# Altium schematic sheet Overview.SchDoc
size A4; Organization: Altium Limited; Address1: L3, 12a Rodborough Rd; Address2: Frenchs Forest; Address3: NSW; Address4: Australia 2086; SheetNumber: 1; SheetTotal: 5
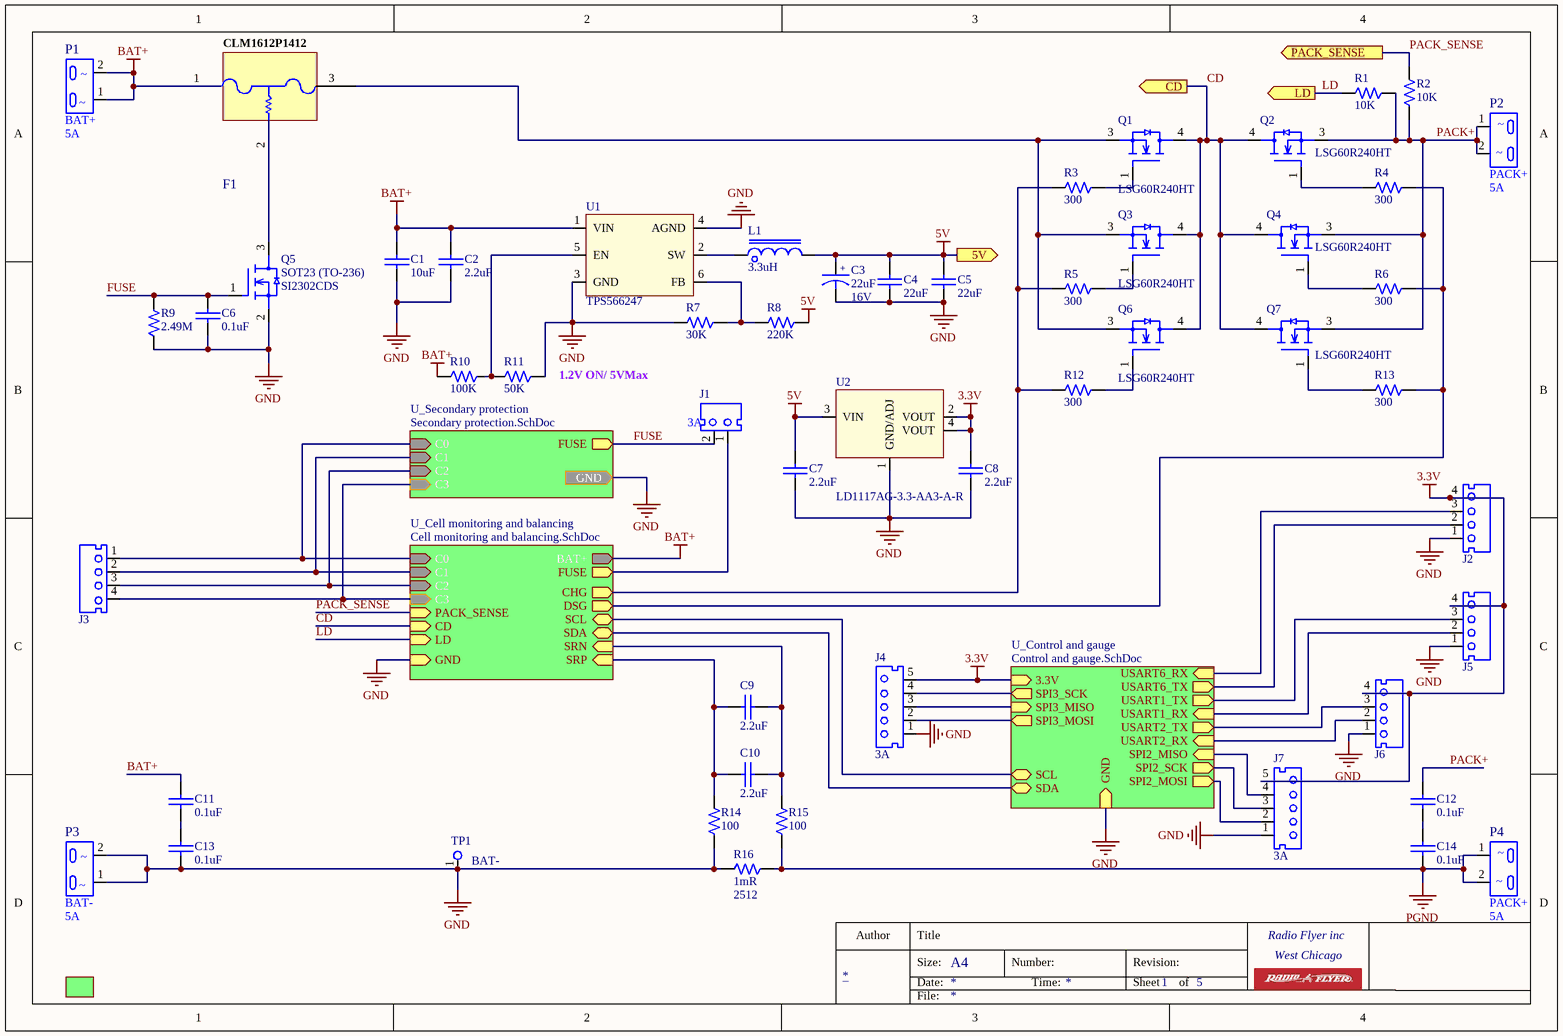
[diagram p0: Overview.SchDoc]

## Parts
C1  value 10uF  [CAPC0603-RW]  (hidden comment: T542021037308)
C2  value 2.2uF  [CAPC0603-RW]  (hidden comment: T542021037308)
C3  value 22uF  Voltage: 16V  [CASE - B]  (hidden comment: T551220435010)
C4  value 22uF  [CAPC0603-RW]  (hidden comment: T542021037308)
C5  value 22uF  [CAPC0603-RW]  (hidden comment: T542021037308)
C6  value 0.1uF  [CAPC0603-RW]  (hidden comment: T542021037308)
C7  value 2.2uF  [CAPC0603-RW]  (hidden comment: T542021037308)
C8  value 2.2uF  [CAPC0603-RW]  (hidden comment: T542021037308)
C9  value 2.2uF  [CAPC0603-RW]  (hidden comment: T542021037308)
C10  value 2.2uF  [CAPC0603-RW]  (hidden comment: T542021037308)
C11  value 0.1uF  [CAPC0603-RW]  (hidden comment: T542021037308)
C12  value 0.1uF  [CAPC0603-RW]  (hidden comment: T542021037308)
C13  value 0.1uF  [CAPC0603-RW]  (hidden comment: T542021037308)
C14  value 0.1uF  [CAPC0603-RW]  (hidden comment: T542021037308)
F1  KED500004-0010  [CLM1612P1412]  (value not drawn)
J1  Current: 3A  [CONN 2P PH=2.5mm B2B-XH-A]  (hidden comment: CCN250000-0102)
J2  T690300164400  [CONN 4P PH=2.5mm 440052-4]  (value not drawn)
J3  T690300164400  [CONN 4P PH=2.5mm 440052-4]  (value not drawn)
J4  Current: 3A  [CONN 5P PH=2.5mm Molex 99-99-0989]  (hidden comment: CCN250001-0105)
J5  T690300164400  [CONN 4P PH=2.5mm 440052-4]  (value not drawn)
J6  T690300164400  [CONN 4P PH=2.5mm 440052-4]  (value not drawn)
J7  Current: 3A  [CONN 5P PH=2.5mm Molex 99-99-0989]  (hidden comment: CCN250001-0105)
L1  value 3.3uH  [IND  CKST0603]  (hidden comment: T621000080700)
P1  MFG Part: BAT+  Current: 5A  [AC INLET 2P DB8-6S1]  (hidden comment: CJP012009-0070)
P2  MFG Part: PACK+  Current: 5A  [AC INLET 2P DB8-6S1]  (hidden comment: CJP012009-0070)
P3  MFG Part: BAT-  Current: 5A  [AC INLET 2P DB8-6S1]  (hidden comment: CJP012009-0070)
P4  MFG Part: PACK+  Current: 5A  [AC INLET 2P DB8-6S1]  (hidden comment: CJP012009-0070)
Q1  MFG Part: LSG60R240HT  [TO252-3]  (hidden comment: T5860038503A6)
Q2  MFG Part: LSG60R240HT  [TO252-3]  (hidden comment: T5860038503A6)
Q3  MFG Part: LSG60R240HT  [TO252-3]  (hidden comment: T5860038503A6)
Q4  MFG Part: LSG60R240HT  [TO252-3]  (hidden comment: T5860038503A6)
Q5  Package: SOT23 (TO-236)  [SOT23-132-RW]  (hidden comment: SI2302CDS)
Q6  MFG Part: LSG60R240HT  [TO252-3]  (hidden comment: T5860038503A6)
Q7  MFG Part: LSG60R240HT  [TO252-3]  (hidden comment: T5860038503A6)
R1  value 10K  [0603-RW]  (hidden comment: T502976002399)
R2  value 10K  [0603-RW]  (hidden comment: T502976002399)
R3  value 300  [0603-RW]  (hidden comment: T502976002399)
R4  value 300  [0603-RW]  (hidden comment: T502976002399)
R5  value 300  [0603-RW]  (hidden comment: T502976002399)
R6  value 300  [0603-RW]  (hidden comment: T502976002399)
R7  value 30K  [0603-RW]  (hidden comment: T502976002399)
R8  value 220K  [0603-RW]  (hidden comment: T502976002399)
R9  value 2.49M  [0603-RW]  (hidden comment: T502976002399)
R10  value 100K  [0603-RW]  (hidden comment: T502976002399)
R11  value 50K  [0603-RW]  (hidden comment: T502976002399)
R12  value 300  [0603-RW]  (hidden comment: T502976002399)
R13  value 300  [0603-RW]  (hidden comment: T502976002399)
R14  value 100  [0603-RW]  (hidden comment: T502976002399)
R15  value 100  [0603-RW]  (hidden comment: T502976002399)
R16  value 1mR  [2512]  (hidden comment: QCF101250-1009)
TP1  BAT-  [RT-01T-1.0B]
U1  MFG Part: TPS566247  [SOT-563]  (hidden comment: CD1053GTF-Z)
U2  MFG Part: LD1117AG-3.3-AA3-A-R  [SOT223]  (hidden comment: T610600036508)

## Sub-sheets
U_Cell monitoring and balancing = Cell monitoring and balancing.SchDoc: BAT+ (out), C0 (in), C1 (in), C2 (in), C3 (in), PACK_SENSE (in), CD (in), FUSE (out), LD (in), SDA (bidir), SCL (bidir), CHG (out), DSG (out), SRN (in), SRP (in), GND (in)
U_Control and gauge = Control and gauge.SchDoc: SDA (bidir), SCL (bidir), 3.3V (in), USART6_RX (in), USART6_TX (out), USART1_TX (out), USART1_RX (in), SPI3_SCK (out), SPI3_MISO (in), USART2_RX (in), SPI3_MOSI (out), USART2_TX (out), SPI2_SCK (out), SPI2_MOSI (out), SPI2_MISO (in), GND (in)
U_Main board frame = Main board frame.SchDoc: no entries
U_Secondary protection = Secondary protection.SchDoc: C0 (in), C1 (in), C2 (in), C3 (in), FUSE (out)

## Ports
5V (out), CD (out), GND (in), LD (out), PACK_SENSE (out)

## Nets
3.3V: C8.1 J2.4 J4.5 J5.4 J6.4 J7.5 U2.2(VOUT) U2.4(VOUT) ; sheet U_Control and gauge/3.3V
5V: C3.1 C4.1 C5.1 C7.1 L1.2 R8.1 U2.3(VIN) ; port 5V
BAT+: C1.1 C2.1 C11.1 F1.1 P1.1 P1.2 R10.2 U1.1(VIN) ; sheet U_Cell monitoring and balancing/BAT+
GND: C1.2 C2.2 C3.2 C4.2 C5.2 C6.2 C7.2 C8.2 C13.2 J2.1 J4.1 J5.1 J6.1 J7.1 P3.1 P3.2 Q5.2(S) R7.2 R9.2 R11.1 R14.1 R16.2 TP1.1 U1.3(GND) U1.4(AGND) U2.1(GND/ADJ) ; port GND, sheet U_Cell monitoring and balancing/GND, sheet U_Control and gauge/GND
PGND: C14.2 P4.1 P4.2 R15.1 R16.1
CD: Q1.4(D) Q2.4(D) Q3.4(D) Q4.4(D) Q6.4(D) Q7.4(D) ; port CD, sheet U_Cell monitoring and balancing/CD
FUSE: C6.1 J1.2 Q5.1(G) R9.1 ; sheet U_Secondary protection/FUSE
LD: R1.2 ; port LD, sheet U_Cell monitoring and balancing/LD
PACK+: C12.1 P2.1 P2.2 Q2.3(S) Q4.3(S) Q7.3(S) R1.1 R2.1
PACK_SENSE: R2.2 ; port PACK_SENSE, sheet U_Cell monitoring and balancing/PACK_SENSE
NetC9_1: C9.1 C10.1 R15.2 ; sheet U_Cell monitoring and balancing/SRN
NetC9_2: C9.2 C10.2 R14.2 ; sheet U_Cell monitoring and balancing/SRP
NetC11_2: C11.2 C13.1
NetC12_2: C12.2 C14.1
NetF1_2: F1.2 Q5.3(D)
NetF1_3: F1.3 Q1.3(S) Q3.3(S) Q6.3(S)
NetJ1_1: J1.1 ; sheet U_Cell monitoring and balancing/FUSE
NetJ2_2: J2.2 ; sheet U_Control and gauge/USART6_TX
NetJ2_3: J2.3 ; sheet U_Control and gauge/USART6_RX
NetJ3_1: J3.1 ; sheet U_Secondary protection/C0, sheet U_Cell monitoring and balancing/C0
NetJ3_2: J3.2 ; sheet U_Secondary protection/C1, sheet U_Cell monitoring and balancing/C1
NetJ3_3: J3.3 ; sheet U_Secondary protection/C2, sheet U_Cell monitoring and balancing/C2
NetJ3_4: J3.4 ; sheet U_Secondary protection/C3, sheet U_Cell monitoring and balancing/C3
NetJ4_2: J4.2 ; sheet U_Control and gauge/SPI3_MOSI
NetJ4_3: J4.3 ; sheet U_Control and gauge/SPI3_MISO
NetJ4_4: J4.4 ; sheet U_Control and gauge/SPI3_SCK
NetJ5_2: J5.2 ; sheet U_Control and gauge/USART1_RX
NetJ5_3: J5.3 ; sheet U_Control and gauge/USART1_TX
NetJ6_2: J6.2 ; sheet U_Control and gauge/USART2_RX
NetJ6_3: J6.3 ; sheet U_Control and gauge/USART2_TX
NetJ7_2: J7.2 ; sheet U_Control and gauge/SPI2_MOSI
NetJ7_3: J7.3 ; sheet U_Control and gauge/SPI2_SCK
NetJ7_4: J7.4 ; sheet U_Control and gauge/SPI2_MISO
NetL1_1: L1.1 U1.2(SW)
NetQ1_1: Q1.1(G) R3.1
NetQ2_1: Q2.1(G) R4.2
NetQ3_1: Q3.1(G) R5.1
NetQ4_1: Q4.1(G) R6.2
NetQ6_1: Q6.1(G) R12.1
NetQ7_1: Q7.1(G) R13.2
NetR3_2: R3.2 R5.2 R12.2 ; sheet U_Cell monitoring and balancing/CHG
NetR4_1: R4.1 R6.1 R13.1 ; sheet U_Cell monitoring and balancing/DSG
NetR7_1: R7.1 R8.2 U1.6(FB)
NetR10_1: R10.1 R11.2 U1.5(EN)
(unnamed): sheet U_Cell monitoring and balancing/SDA, sheet U_Control and gauge/SDA
(unnamed): sheet U_Cell monitoring and balancing/SCL, sheet U_Control and gauge/SCL

## Notes on the sheet
- (near R11) 1.2V ON/ 5VMax
- Author
- Title
- Size:
- Date:
- A4
- Number:
- Time:
- Revision:
- Sheet
- of
- Radio Flyer inc
- West Chicago
- File:
- (in symbol AC INLET 2P DB8-6S1 Polar) ~
- (in symbol CAP E 22uF 16V 20% SMD_VEJ220M1CTR-0405) +

## Library data of the parts
C1 C2 C4-C14 = CAP0603 0.01uF 16V 10%_X7R_WALSIN: CAP X7R .01UF 16V +-10% 0603 WALSIN L; Tolerance: 10%; Type: Capacitor; CREATE_NAME: Nathan; DIP&SMD: SMD; SAP: T542021037308; PACKAGE: CAPC0603; Vendor Name: *; MFG: WALSIN; MFG Part: *; Other: X7R; CREATE_TIME: 13-July-2016; Customer Specific: N/A; Voltage: 16V
C3 = CAP E 22uF 16V 20% SMD_VEJ220M1CTR-0405: E 22UF 16V +-20% 4.3X4. VEJ220M1C K; MFG: LELON; Type: Capacitor; CREATE_NAME: Nathan; DIP&SMD: SMD; SAP: T551220435010; MFG Part: VEJ220M1CTR-0405; Other: *; CREATE_TIME: 01-Mar-2019; Customer Specific: N/A; PACKAGE: CASE - B
F1 = CLM1612P1412: 3 Terminal Fuse 12A 3S; MFG Part: YG212-12031; SAP: T575009990164; MFG: XIAMEN G&P; Type: LED; CREATE_NAME: Tom; DIP&SMD: DIP; Vendor Name: *; Vendor Code: *; CREATE_TIME: 14-Apr-2015
J1 = CONN 2P PH=2.5mm B2B-XH-A: GP CONNECTOR B2B-XH-A 2 PIN G; MFG Part: HAA250A-2A-WHITE; Value: 2.5mm; SAP: T690300041200; MFG: 金瑞康; Vendor Name: 亿源电子有限公司; Vendor Code: 10009989; DIP&SMD: DIP; Type: Connector
J2 J3 J5 J6 = CONN 4P PH=2.5mm 440052-4_TE: GP CONNECTOR B4B-XH-A 4 PIN; Value: 2.5mm; MFG: TE; DIP&SMD: DIP; CREATE_NAME: Nathan; SAP: T690300164400; MFG Part: 440052-4; Vendor Name: *; Vendor Code: *; Type: Connector; CREATE_TIME: 10-APR-2019; Current: *
J4 J7 = CONN 5P PH=2.5mm Molex 99-99-0989: CONNECTOR 5PIN P=2.5mm 180'; Value: 2.5mm; SAP: T690300024200; MFG: Molex; CREATE_NAME: Nathan; DIP&SMD: DIP; MFG Part: 99-99-0989; Vendor Name: *; Vendor Code: *; Type: Connector; CREATE_TIME: 10-Feb-2015
L1 = IND 3.3uH CKST0603-3.3UH\M: 3.3UH 6A 100K SMD CENKER CKST060 K; Type: INDUCTOR; CREATE_NAME: Nathan; DCR: 26mohm; Isat: 9.5A; SAP: T621000080700; MFG: CENKER; Vendor Code: *; Vendor Name: *; CREATE_TIME: 13-Mar-2019; Irms: 6A; MFG Part: CKST0603-3.3UH\M; DIP&SMD: SMD
P1-P4 = AC INLET 2P DB8-6S1 Polar: AC SOCKET 2P D2.36 2.5A 250V VDE BLACK; SAP: T690300011600; MFG: 金明浩; Vendor Name: 深圳市金明浩电子科技有限公司; Vendor Code: 10010007; DIP&SMD: DIP; Value: *; Type: Connector
Q1-Q4 Q6 Q7 = NMOS LSG60R240HT: NMOS 600V LSG60R240HT TO252( LONTEN K; Current: 17A; Type: N-CHANNEL MOSFET; CREATE_NAME: Nathan; DIP&SMD: SMD; SAP: T5860038503A6; Pd: *; Vendor Code: *; Vendor Name: *; Voltage: 600V; MFG: LONTEN; CREATE_TIME: 12-Oct-2019; Rds: *; Customer Specific: N/A; Package: TO252
Q5 = SI2302CDS: NMOS FET-Si2302CDS; MFG: VISHAY; CREATE_NAME: Nathan; DIP&SMD: SMD; SAP: *; Power: *; Vendor Code: *; Vendor Name: *; Voltage: *; Current: *; Type: NMOS; CREATE_TIME: 17-Nov-2020; Customer Specific: N/A; MFG Part: SI2302CDS
R1-R15 = RES0603 1/10W +-1% 976 OHM 100PPM: CHIP 976 OHM 100PPM +-1% 0603 WALS L; Power: 0.1W; MFG: WALSIN; CREATE_NAME: Tom; DIP&SMD: SMD; Vendor Code: *; SAP: T502976002399; Vendor Name: *; MFG Part: *; Type: Resistor; CREATE_TIME: 17-Dec-2015; PACKAGE: 0603; TOL: +-1%; Customer Specific: N/A
R16 = RES2512 1W 1% 10 OHM: CHIP RES. 10 OHM 1W 1% 2512; Vendor Code: 10010262; SAP: T502100A07399; Vendor Name: 东莞市晴远电子有限公司; DIP&SMD: SMD; Power: 1W; MFG Part: *; MFG: *; TOL: 1%; Type: Resistor; Customer Specific: N/A; PACKAGE: 2512
TP1 = TERMINAL RT-01T-1.0B: TERMINAL 11MM G; CREATE_NAME: Nathan; SAP: T690300035900; MFG: 利民豐（JST); DIP&SMD: DIP; MFG Part: RT-01T-1.0B; Vendor Name: *; Vendor code: *; Type: *; Package: *; CREATE_TIME: 07-July-2016
U1 = CD1053GTF-Z: MFG: MPS; CREATE_NAME: Nathan; DIP&SMD: SMD; SAP: *; Vendor Code: *; Vendor Name: *; Package: SOT-563; CREATE_TIME: 13-Jun-2020; Customer Specific: N/A
U2 = LD1117AG-3.3-AA3-A-R_101: REG LD1117AG-3.3-AA3- SOT223 UTC L; CREATE_NAME: Tom; DIP&SMD: SMD; MFG: UTC; Vendor Code: *; Vendor Name: *; SAP: T610600036508; Type: IC; CREATE_TIME: 23-Apr-2019; Customer Specific: N/A